# Altium schematic sheet [03]-CONNECTOR,SBC.SchDoc: S32K1_CONTROLLER (part 1 of 3)
size A3; SheetNumber: 03; SheetTotal: 11
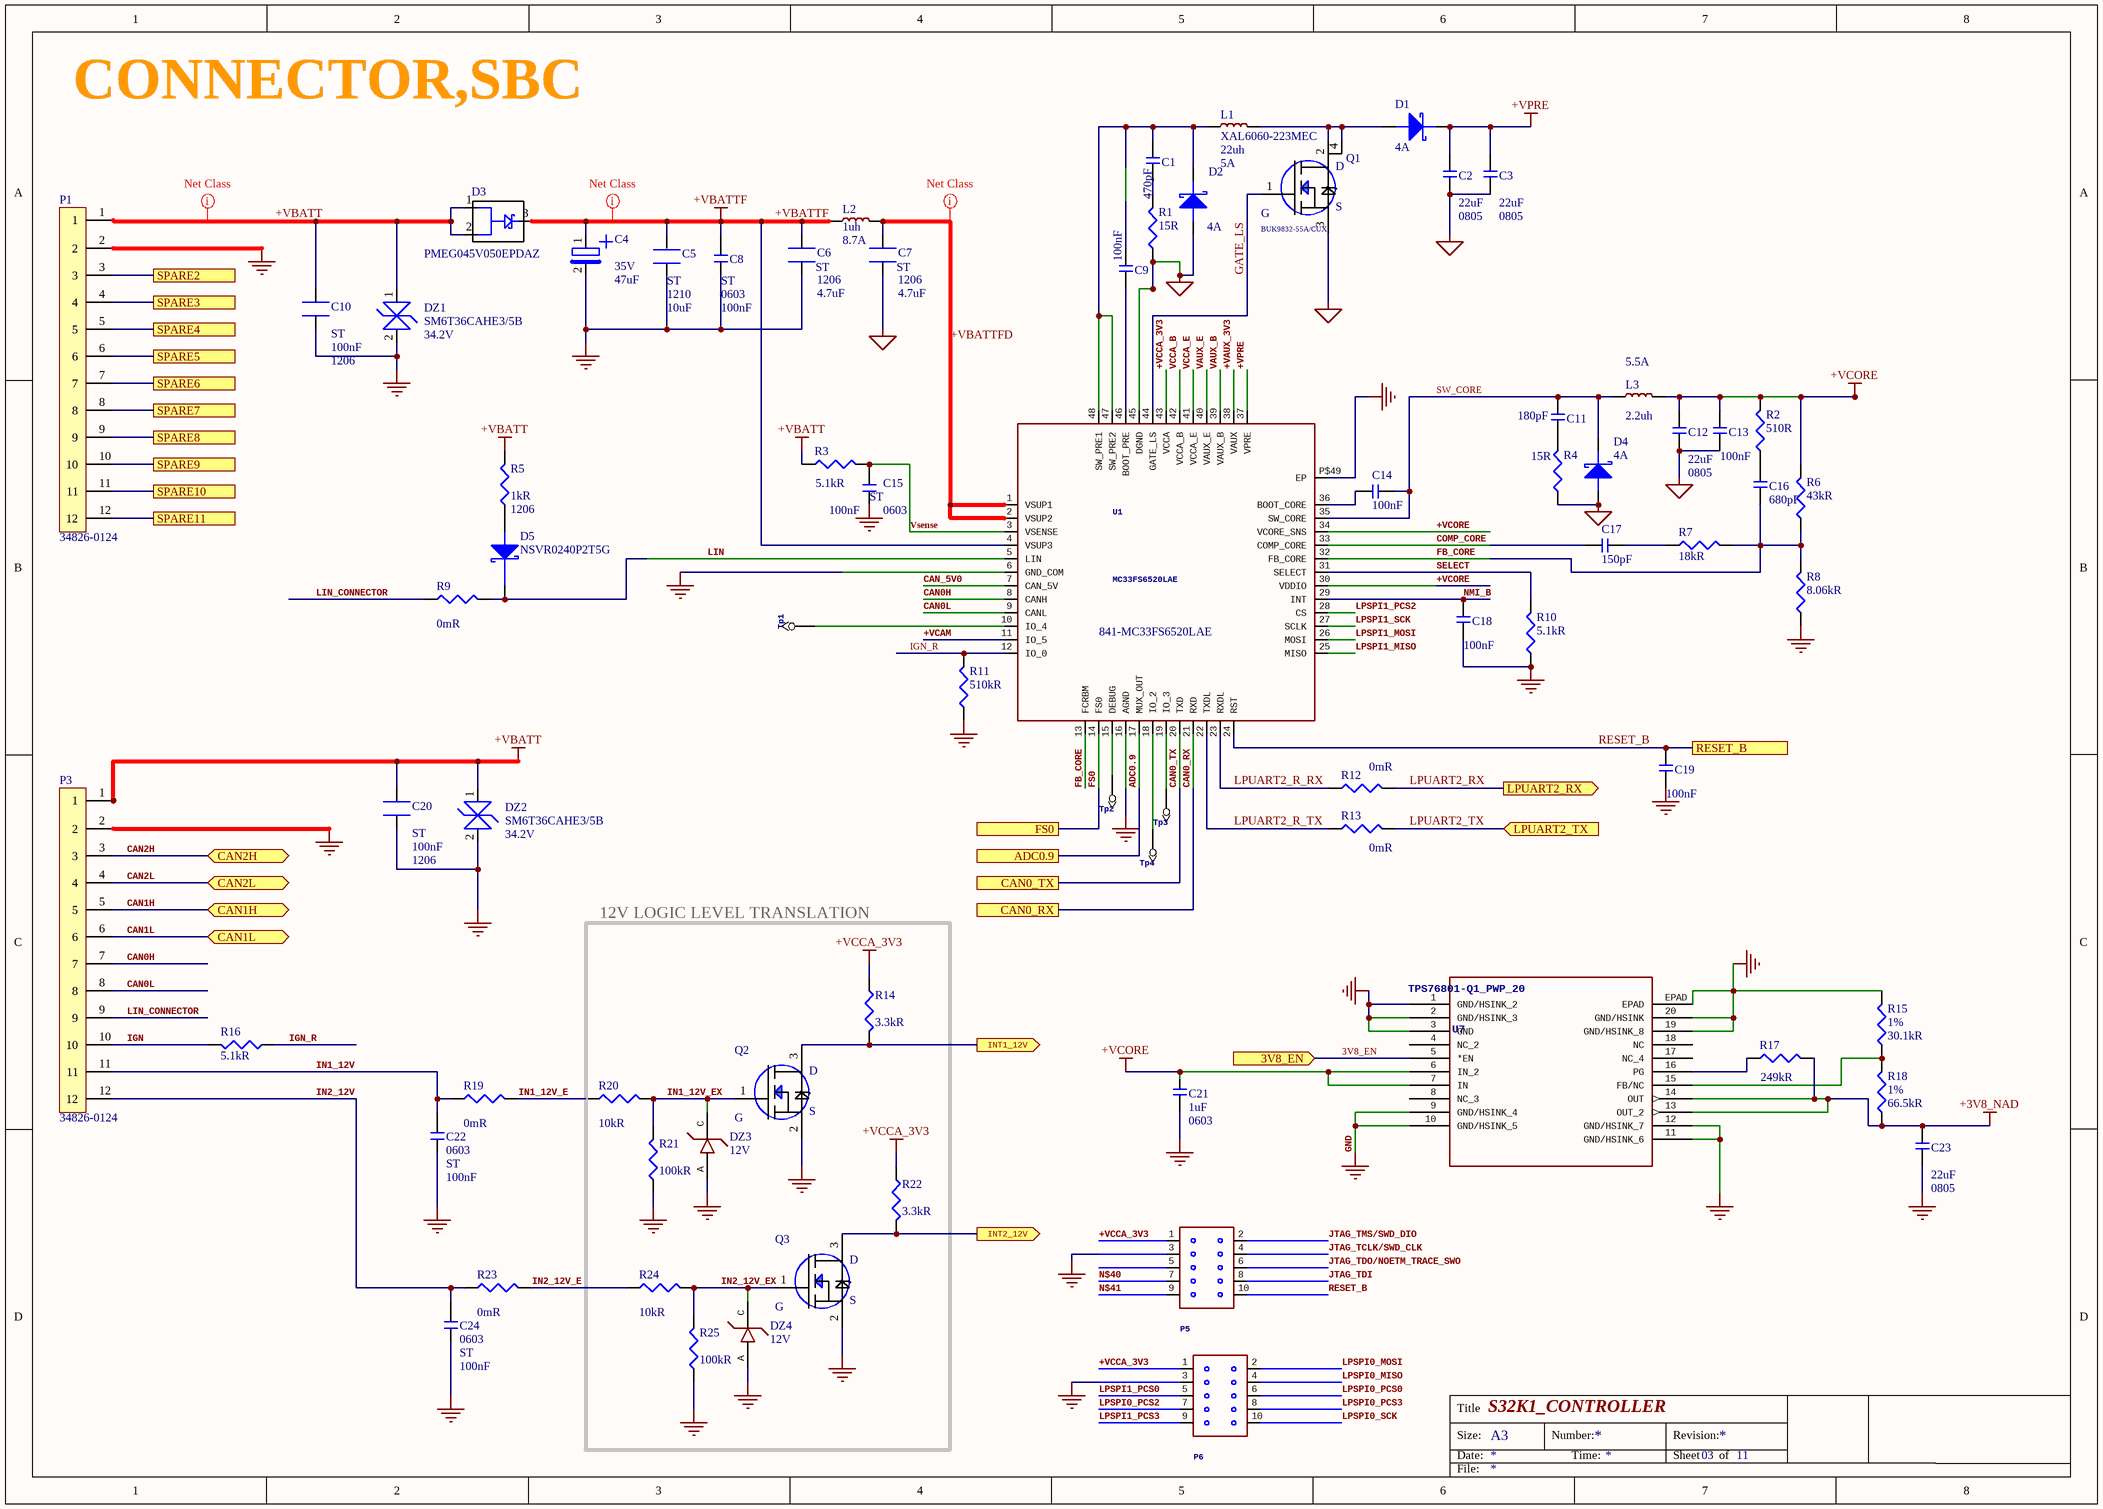
[diagram p0: [03]-CONNECTOR,SBC.SchDoc]

## Parts
C1  Parameter 1: 470pF  [CAP0402]  (hidden comment: C0402S471K3RACAUTO)
C2  Capacitance: 22uF  Case/Package: 0805  [CAP0805]  (hidden comment: GRT21BR61E226ME13L)
C3  Capacitance: 22uF  Case/Package: 0805  [CAP0805]  (hidden comment: GRT21BR61E226ME13L)
C4  Voltage Rating: 35V  Capacitance: 47uF  [CAPAE7263X58L]  (hidden comment: EMZA350ADA470MF61G)
C5  Parameter 1: ST  Case Code (Imperial): 1210  Capacitance: 10uF  (hidden comment: CGA6P3X7S1H106K250AE)
C6  Case Code (Imperial): 1206  Capacitance: 4.7uF  Parameter 1: ST  [CAP1206]  (hidden comment: CGA5L3X7R1H475K160AE)
C7  Case Code (Imperial): 1206  Capacitance: 4.7uF  Parameter 1: ST  [CAP1206]  (hidden comment: CGA5L3X7R1H475K160AE)
C8  Case Code (Imperial): 0603  Parameter 1: ST  Capacitance: 100nF  [CAP0603]  (hidden comment: 06035C104K4Z2A)
C9  Capacitance: 100nF  [CAP0402]  (hidden comment: GCM155R71C104KA55D)
C10  Parameter 1: ST  Capacitance: 100nF  Case/Package: 1206  [CAP1206]  (hidden comment: C1206X104K2RACAUTO)
C11  Parameter 1: 180pF  [CAP0402]  (hidden comment: UMK105CH181JVHF)
C12  Capacitance: 22uF  Case/Package: 0805  [CAP0805]  (hidden comment: GRT21BR61E226ME13L)
C13  Capacitance: 100nF  [CAP0402]  (hidden comment: GCM155R71C104KA55D)
C14  Capacitance: 100nF  [CAP0402]  (hidden comment: GCM155R71C104KA55D)
C15  Case Code (Imperial): 0603  Parameter 1: ST  Capacitance: 100nF  [CAP0603]  (hidden comment: 06035C104K4Z2A)
C16  Capacitance: 680pF  [CAP0402]  (hidden comment: C0402C681K5RACAUTO)
C17  Capacitance: 150pF  [CAP0402]  (hidden comment: GCM1555C1H151JA16D)
C18  Capacitance: 100nF  [CAP0402]  (hidden comment: GCM155R71C104KA55D)
C19  Capacitance: 100nF  [CAP0402]  (hidden comment: GCM155R71C104KA55D)
C20  Parameter 1: ST  Capacitance: 100nF  Case/Package: 1206  [CAP1206]  (hidden comment: C1206X104K2RACAUTO)
C21  Capacitance: 1uF  Case/Package: 0603  [CAP0603]  (hidden comment: CGA3E1X7R1C105K080AC)
C22  Case Code (Imperial): 0603  Parameter 1: ST  Capacitance: 100nF  [CAP0603]  (hidden comment: 06035C104K4Z2A)
C23  Capacitance: 22uF  Case/Package: 0805  [CAP0805]  (hidden comment: GRT21BR61E226ME13L)
C24  Case Code (Imperial): 0603  Parameter 1: ST  Capacitance: 100nF  [CAP0603]  (hidden comment: 06035C104K4Z2A)
D1  Average Rectified Current: 4A  [DO-214AA]  (hidden comment: SSB43LHE3_A/I)
D2  Average Rectified Current: 4A  [DO-214AA]  (hidden comment: SSB43LHE3_A/I)
D3  PMEG045V050EPDAZ  [SOT1289]
D4  Average Rectified Current: 4A  [DO-214AA]  (hidden comment: SSB43LHE3_A/I)
D5  NSVR0240P2T5G  [SOD923]
DZ1  SM6T36CAHE3/5B  Breakdown Voltage: 34.2V  [DO-214AA]
DZ2  SM6T36CAHE3/5B  Breakdown Voltage: 34.2V  [DO-214AA]
DZ3  Zener Voltage: 12V  [MINI50_TO236]  (hidden comment: SZMMBZ5242BL**G)
DZ4  Zener Voltage: 12V  [MINI50_TO236]  (hidden comment: SZMMBZ5242BL**G)
L1  XAL6060-223MEC  Inductance: 22uh  Max DC Current: 5A  [INDP6666X61L]
L2  Inductance: 1uh  Saturation Current: 8.7A  [INDC4040X21L]  (hidden comment: XAL4020-102MEB)
L3  Inductance: 2.2uh  Max DC Current: 5.5A  [XAL4020]  (hidden comment: XAL4020-222MEB)
P1  34826-0124
P3  34826-0124
P5  FTSH105-05  [WEONREFERENCEPLATFORM_FTSH105-05]  (value not drawn)
P6  FTSH105-05  [WEONREFERENCEPLATFORM_FTSH105-05]  (value not drawn)
Q1  BUK9832-55A/CUX  [SOT230P700X180-4L]
Q2  BSS138BKW,115  [SOT323_bss138bkw]  (value not drawn)
Q3  BSS138BKW,115  [SOT323_bss138bkw]  (value not drawn)
R1  Resistance: 15R  [RES0402]  (hidden comment: ERJ-2GEJ150X)
R2  Resistance: 510R  [RES0402]  (hidden comment: RK73B1ETTP511J)
R3  Resistance: 5.1kR  [RES0402]  (hidden comment: ERJ-2GEJ512X)
R4  Resistance: 15R  [RES0402]  (hidden comment: ERJ-2GEJ150X)
R5  Resistance: 1kR  Case/Package: 1206  [RES1206]  (hidden comment: ERJ-8GEYJ102V)
R6  Resistance: 43kR  [RES0402]  (hidden comment: RK73H1ETTP4302F)
R7  Resistance: 18kR  [RES0402]  (hidden comment: RK73B1ETTP183J)
R8  Resistance: 8.06kR  [RES0402]  (hidden comment: RK73H1ETTP8061F)
R9  Resistance: 0mR  [RES0402]  (hidden comment: ERJ-2GE0R00X)
R10  Resistance: 5.1kR  [RES0402]  (hidden comment: RK73B1ETTP512J)
R11  Resistance: 510kR  [RES0402]  (hidden comment: RK73B1ETTP514J)
R12  Resistance: 0mR  [RES0402]  (hidden comment: ERJ-2GE0R00X)
R13  Resistance: 0mR  [RES0402]  (hidden comment: ERJ-2GE0R00X)
R14  Resistance: 3.3kR  [RES0402]  (hidden comment: ERJ-2GEJ332X)
R15  Tolerance: 1%  Resistance: 30.1kR  [RES0402]  (hidden comment: RK73H1ETTP3012F)
R16  Resistance: 5.1kR  [RES0402]  (hidden comment: RK73B1ETTP512J)
R17  Resistance: 249kR  [RES0402]  (hidden comment: RK73H1ETTP2493F)
R18  Tolerance: 1%  Resistance: 66.5kR  (hidden comment: RK73H1ETTP6652F)
R19  Resistance: 0mR  [RES0402]  (hidden comment: ERJ-2GE0R00X)
R20  Resistance: 10kR  [RES0402]  (hidden comment: ERJ-2GEJ103X)
R21  Resistance: 100kR  [RES0402]  (hidden comment: ERJ-2GEJ104X)
R22  Resistance: 3.3kR  [RES0402]  (hidden comment: ERJ-2GEJ332X)
R23  Resistance: 0mR  [RES0402]  (hidden comment: ERJ-2GE0R00X)
R24  Resistance: 10kR  [RES0402]  (hidden comment: ERJ-2GEJ103X)
R25  Resistance: 100kR  [RES0402]  (hidden comment: ERJ-2GEJ104X)
Tp1  TP  [TestPoint]  (value not drawn)
Tp2  TP  [TestPoint]  (value not drawn)
Tp3  TP  [TestPoint]  (value not drawn)
Tp4  TP  [TestPoint]  (value not drawn)
U1  MC33FS6520LAE  Supplier Part Number 1: 841-MC33FS6520LAE  [WEONREFERENCEPLATFORM_LQFP48_7X7]
U7  TPS76801-Q1_PWP_20  [WEONREFERENCEPLATFORM_PWP20_3P38X2P4]

## Blocks framed on the sheet
12V LOGIC LEVEL TRANSLATION: DZ3 DZ4 Q2 Q3 R14 R20-R22 R24 R25

## Ports
3V8_EN (in), ADC0.9, CAN0_RX, CAN0_TX, CAN1H (bidir), CAN1L (bidir), CAN2H (bidir), CAN2L (bidir), FS0, INT1_12V (out), INT2_12V (out), LPUART2_RX (out), LPUART2_TX (in), RESET_B, SPARE2, SPARE3, SPARE4, SPARE5, SPARE6, SPARE7, SPARE8, SPARE9, SPARE10, SPARE11

## Nets
+3V8_NAD: C23.1 R17.2 R18.1 U7.13(OUT_2) U7.14(OUT)
+VBATT: C10.1 C20.1 D3.1(A) D3.2(A) DZ1.1 DZ2.1 P1.1 P3.1 R3.1 R5.2
+VBATTF: C4.1 C5.1 C6.1 C8.1 D3.3(K) L2.1 U1.4(VSUP3)
+VCCA_3V3: P5.1 P6.1 R14.1 R22.1 U1.43(VCCA)
+VCORE: C12.1 C13.1 C21.1 L3.2 R2.2 R6.2 U1.30(VDDIO) U1.34(VCORE_SNS) U7.6(IN_2) U7.7(IN)
+VPRE: C2.1 C3.1 D1.1(Cathode) U1.37(VPRE)
GND: C4.2 C5.2 C6.2 C8.2 C10.2 C15.2 C18.2 C19.2 C20.2 C21.2 C22.2 C23.2 C24.2 DZ1.2 DZ2.2 DZ3.A DZ4.A P1.2 P3.2 P5.3 P6.3 Q2.2(S) Q3.2(S) R8.1 R10.1 R11.1 R15.2 R21.1 R25.1 U1.6(GND_COM) U1.16(AGND) U1.P$49(EP) U7.1(GND/HSINK_2) U7.2(GND/HSINK_3) U7.3(GND) U7.9(GND/HSINK_4) U7.10(GND/HSINK_5) U7.11(GND/HSINK_6) U7.12(GND/HSINK_7) U7.19(GND/HSINK_8) U7.20(GND/HSINK) U7.EPAD
PGND: C2.2 C3.2 C7.2 C12.2 C13.2 D2.2(Anode) D4.2(Anode) Q1.3(S) R1.1 R4.1 U1.45(DGND)
3V8_EN: U7.5(*EN) ; port 3V8_EN
+VAUX_3V3: U1.38(VAUX)
+VBATTFD: C7.1 L2.2 U1.1(VSUP1) U1.2(VSUP2)
+VCAM: U1.11(IO_5)
ADC0.9: U1.17(MUX_OUT) ; port ADC0.9
CAN0_RX: U1.21(RXD) ; port CAN0_RX
CAN0_TX: U1.20(TXD) ; port CAN0_TX
CAN0H: P3.7 U1.8(CANH)
CAN0L: P3.8 U1.9(CANL)
CAN1H: P3.5 ; port CAN1H
CAN1L: P3.6 ; port CAN1L
CAN2H: P3.3 ; port CAN2H
CAN2L: P3.4 ; port CAN2L
CAN_5V0: U1.7(CAN_5V)
COMP_CORE: C17.1 U1.33(COMP_CORE)
FB_CORE: C16.2 R6.1 R7.2 R8.2 U1.13(FCRBM) U1.32(FB_CORE)
FS0: U1.14(FS0) ; port FS0
GATE_LS: Q1.1(G) U1.44(GATE_LS)
IGN: P3.10 R16.2
IGN_R: R11.2 R16.1 U1.12(IO_0)
IN1_12V: C22.1 P3.11 R19.1
IN1_12V_E: R19.2 R20.1
IN1_12V_EX: DZ3.C Q2.1(G) R20.2 R21.2
IN2_12V: C24.1 P3.12 R23.1
IN2_12V_E: R23.2 R24.1
IN2_12V_EX: DZ4.C Q3.1(G) R24.2 R25.2
INT1_12V: Q2.3(D) R14.2 ; port INT1_12V
INT2_12V: Q3.3(D) R22.2 ; port INT2_12V
JTAG_TCLK/SWD_CLK: P5.4
JTAG_TDI: P5.8
JTAG_TDO/NOETM_TRACE_SWO: P5.6
JTAG_TMS/SWD_DIO: P5.2
LIN: D5.1(Cathode) R9.2 U1.5(LIN)
LIN_CONNECTOR: P3.9 R9.1
LPSPI0_MISO: P6.4
LPSPI0_MOSI: P6.2
LPSPI0_PCS0: P6.6
LPSPI0_PCS2: P6.7
LPSPI0_PCS3: P6.8
LPSPI0_SCK: P6.10
LPSPI1_MISO: U1.25(MISO)
LPSPI1_MOSI: U1.26(MOSI)
LPSPI1_PCS0: P6.5
LPSPI1_PCS2: U1.28(CS)
LPSPI1_PCS3: P6.9
LPSPI1_SCK: U1.27(SCLK)
LPUART2_R_RX: R12.1 U1.23(RXDL)
LPUART2_R_TX: R13.1 U1.22(TXDL)
LPUART2_RX: R12.2 ; port LPUART2_RX
LPUART2_TX: R13.2 ; port LPUART2_TX
N$40: P5.7
N$41: P5.9
NMI_B: C18.1 U1.29(INT)
RESET_B: C19.1 P5.10 U1.24(RST) ; port RESET_B
SELECT: R10.2 U1.31(SELECT)
SPARE2: P1.3 ; port SPARE2
SPARE3: P1.4 ; port SPARE3
SPARE4: P1.5 ; port SPARE4
SPARE5: P1.6 ; port SPARE5
SPARE6: P1.7 ; port SPARE6
SPARE7: P1.8 ; port SPARE7
SPARE8: P1.9 ; port SPARE8
SPARE9: P1.10 ; port SPARE9
SPARE10: P1.11 ; port SPARE10
SPARE11: P1.12 ; port SPARE11
SW_CORE: C11.1 C14.2 D4.1(Cathode) L3.1 U1.35(SW_CORE)
VAUX_B: U1.39(VAUX_B)
VAUX_E: U1.40(VAUX_E)
VCCA_B: U1.42(VCCA_B)
VCCA_E: U1.41(VCCA_E)
Vsense: C15.1 R3.2 U1.3(VSENSE)
NetC1_1: C1.1 C9.1 D2.1(Cathode) L1.1 U1.47(SW_PRE2) U1.48(SW_PRE1)
NetC1_2: C1.2 R1.2
NetC9_2: C9.2 U1.46(BOOT_PRE)
NetC11_2: C11.2 R4.2
NetC14_1: C14.1 U1.36(BOOT_CORE)
NetC16_1: C16.1 R2.1
NetC17_2: C17.2 R7.1
NetD1_2: D1.2(Anode) L1.2 Q1.2(D) Q1.4
NetD5_2: D5.2(Anode) R5.1
NetR15_1: R15.1 R18.2 U7.15(FB/NC)
NetR17_1: R17.1 U7.16(PG)
NetTp1_1: Tp1.1 U1.10(IO_4)
NetTp2_1: Tp2.1 U1.15(DEBUG)
NetTp3_1: Tp3.1 U1.19(IO_3)
NetTp4_1: Tp4.1 U1.18(IO_2)

Not connected (* = marked no-connect by the designer): P5 5; U7 4(NC_2) 8(NC_3) 17(NC_4) 18(NC)

## Layout directives
net class +power: +VBATT, +VBATTF, +VBATTFD

## Notes on the sheet
- CONNECTOR,SBC
- Title
- Size:
- Date:
- A3
- Number:
- Time:
- Revision:
- Sheet
- of
- File: